# EAGLE design CHIP SmartPhone Core Rev 0.3 (EAGLE 8.1.1)
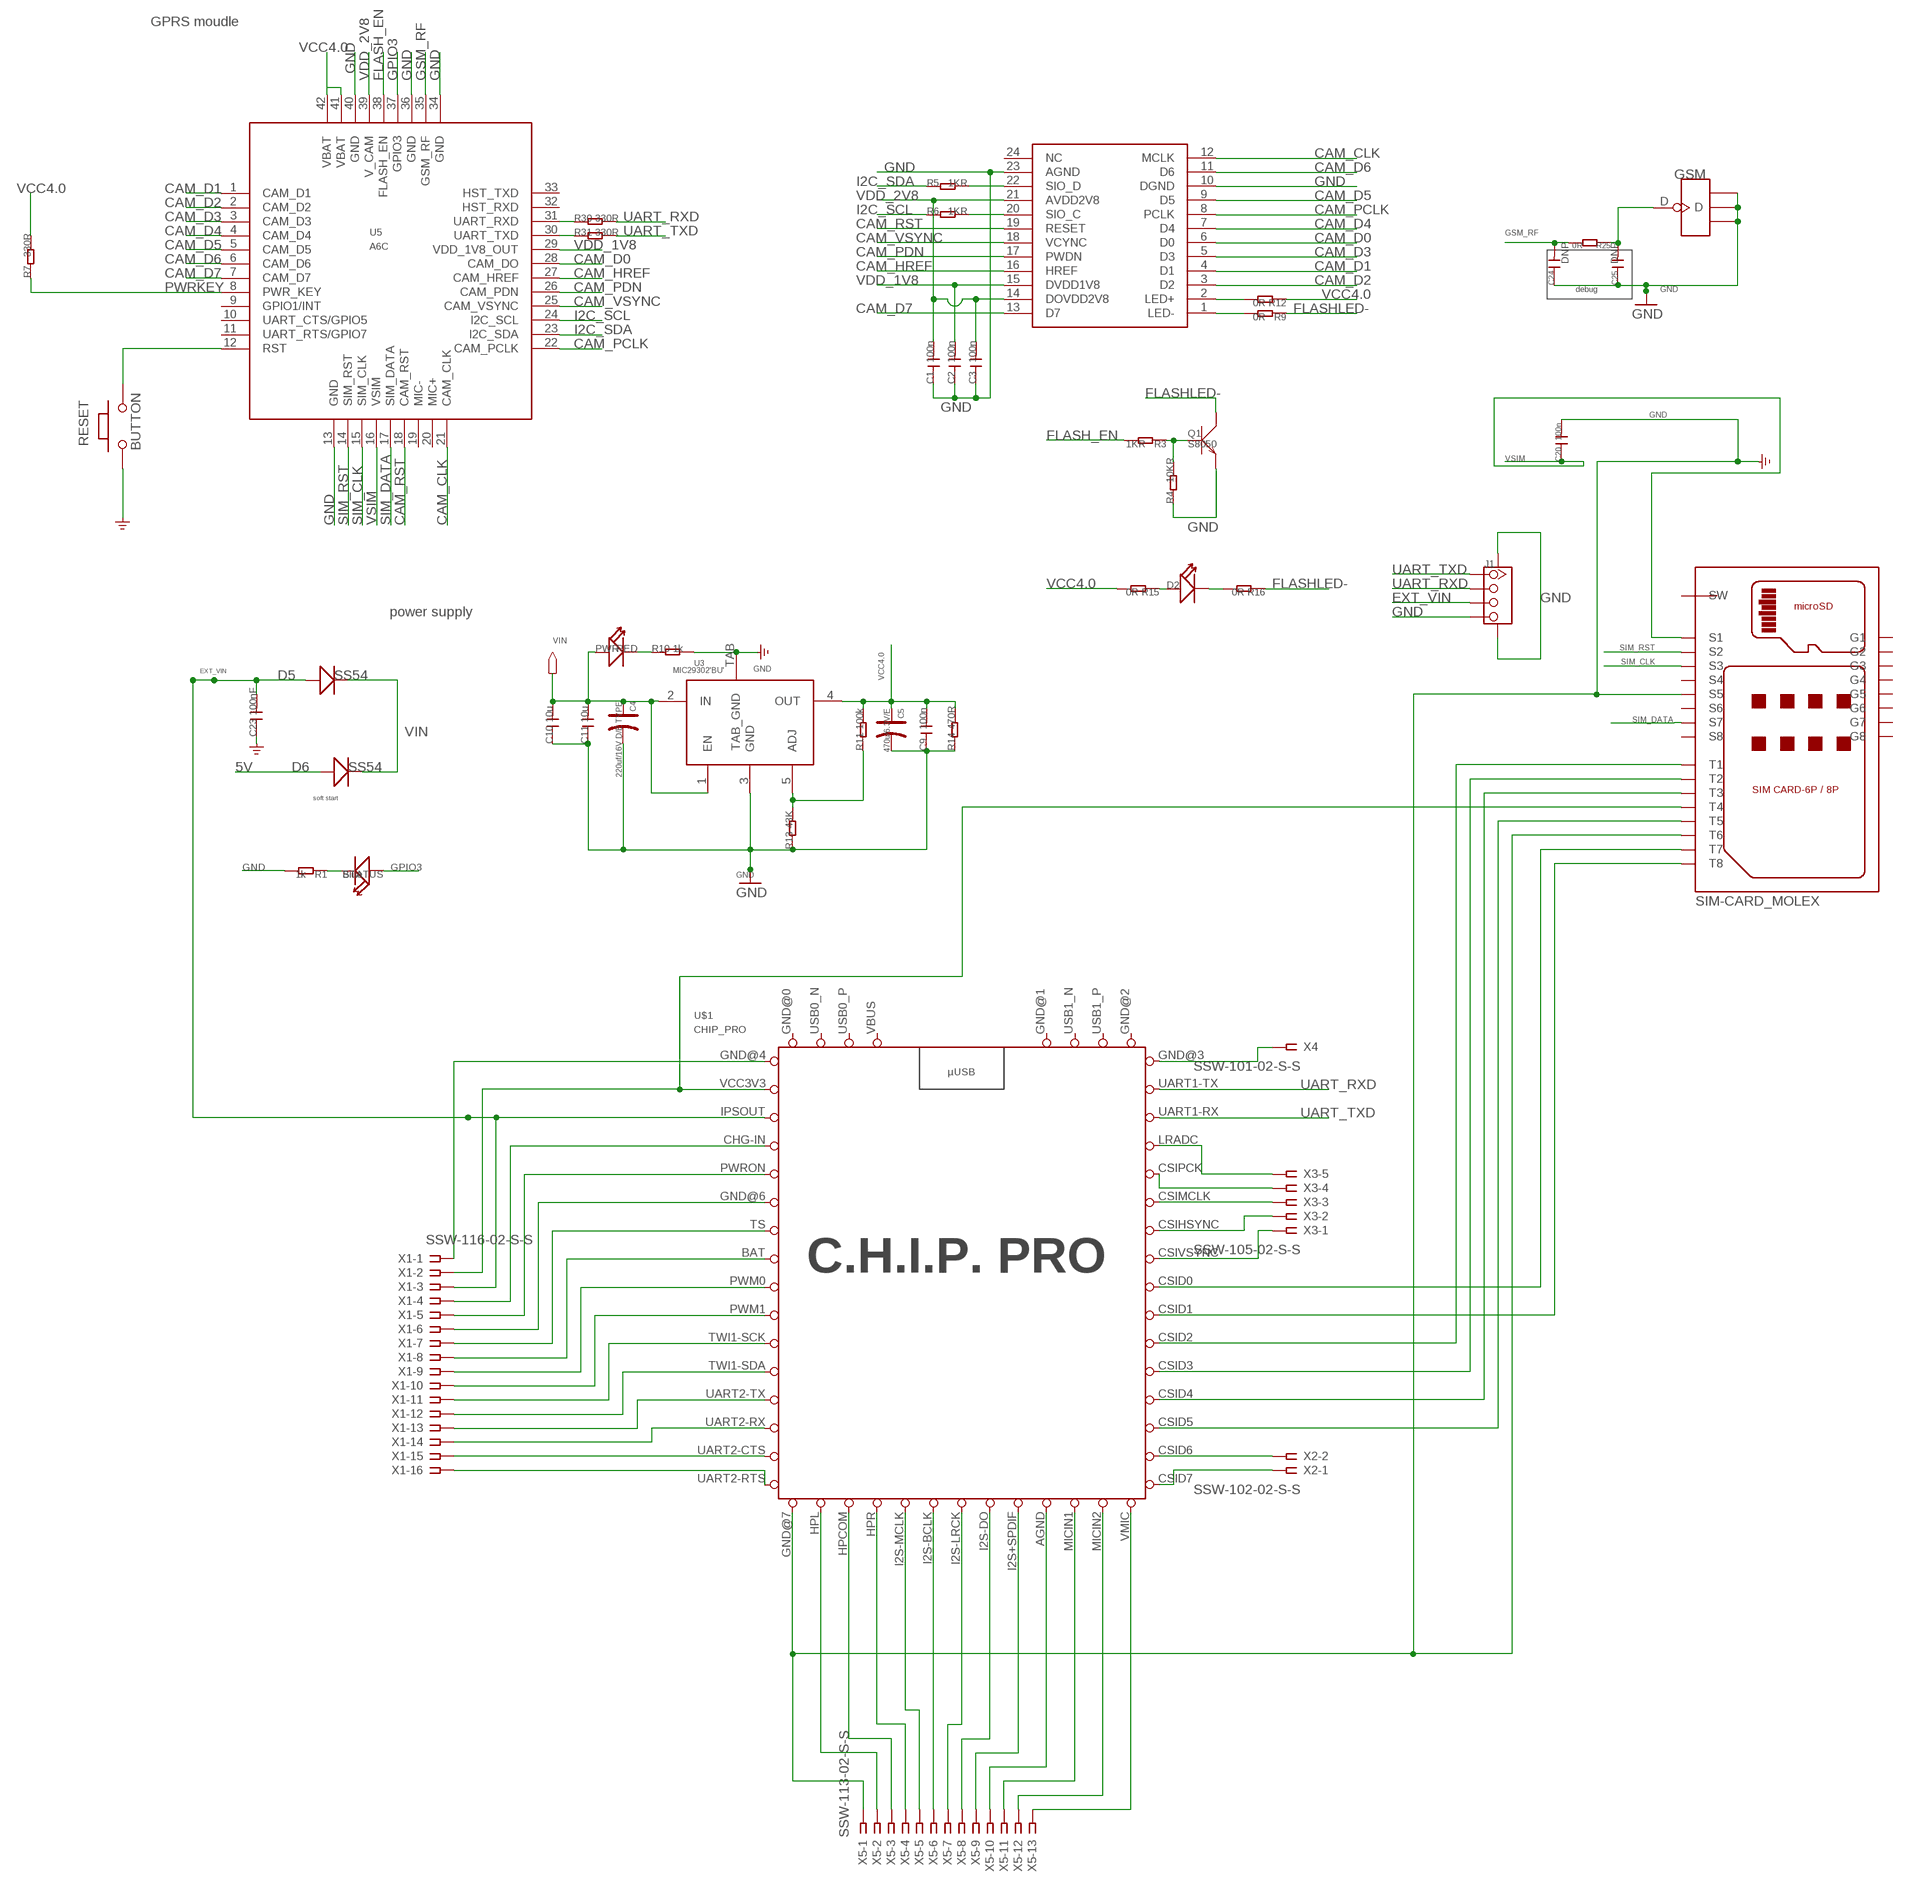
[diagram p0: schematic, sheet 1]

## Parts
C1  100n  C-0603  [C0603]
C2  100n  C-0603  [C0603]
C3  100n  C-0603  [C0603]
C4  220uf/16V D/E TYPE  006-CAP_AVX_D  [AVX_D]
C5  470u/6.3V/E  006-CAP_AVX_D  [AVX_D]
C9  100n  C-0603  [C0603]
C10  10u  C-0603  [C0603]
C11  10u  C-0603  [C0603]
C20  100n  C-0603  [C0603]
C23  100nF  C-0603  [C0603]
C24  DNP  C-0402  [C0402]
C25  DNP  C-0402  [C0402]
D2  LED'0805'  [LED-0805]
D5  SS54  D'MBRS240LT3'  [SMB]
D6  SS54  D'MBRS240LT3'  [SMB]
GSM  ANTENNA-U-FL  [4P-U-FL]
J1  TWIG-4P-2.0-SMD-FEMALE-REINFORCE'90D'  [4P-SMD-2.0-90D]
PWR  RED  007-LED0603  [D0603]
Q1  S8050  TRANSISTOR-NPN-SOT23  [SOT23]
R1  1k  R-0603  [R0603]
R3  1KR  R-0603  [R0603]
R4  10KR  R-0603  [R0603]
R5  1KR  R-0603  [R0603]
R6  1KR  R-0603  [R0603]
R7  330R  R-0603  [R0603]
R9  0R  R-0603  [R0603]
R10  1k  R-0603  [R0603]
R11  100k  R-0603  [R0603]
R12  0R  R-0603  [R0603]
R13  43K  R-0603  [R0603]
R14  470R  R-0603  [R0603]
R15  0R  R-0603  [R0603]
R16  0R  R-0603  [R0603]
R25  0R  R-0402  [R0402]
R30  330R  R-0603  [R0603]
R31  330R  R-0603  [R0603]
RESET  BUTTON  PB157  [157SW]
STATUS  Blue  007-LED0603  [D0603]
U1  FPC-SOCKET-0.5-24P  [24P-0.5-90D]
U3  MIC29302'BU'  [TO-263]
U5  A6C  [A6C]
U$1  CHIP_PRO  [CHIP_PRO]
U$4  SIM-CARD_MOLEX  [SIM-CARD_MOLEX]
X1  SSW-116-02-S-S  [SSW-116-02-S-S]
X2  SSW-102-02-S-S  [SSW-102-02-S-S]
X3  SSW-105-02-S-S  [SSW-105-02-S-S]
X4  SSW-101-02-S-S  [SSW-101-02-S-S]
X5  SSW-113-02-S-S  [SSW-113-02-S-S]

## Nets
5V: D6.+
CAM_CLK: U1.12(MCLK) U5.21(CAM_CLK)
CAM_D0: U1.6(D0) U5.28(CAM_DO)
CAM_D1: U1.4(D1) U5.1(CAM_D1)
CAM_D2: U1.3(D2) U5.2(CAM_D2)
CAM_D3: U1.5(D3) U5.3(CAM_D3)
CAM_D4: U1.7(D4) U5.4(CAM_D4)
CAM_D5: U1.9(D5) U5.5(CAM_D5)
CAM_D6: U1.11(D6) U5.6(CAM_D6)
CAM_D7: U1.13(D7) U5.7(CAM_D7)
CAM_HREF: U1.16(HREF) U5.27(CAM_HREF)
CAM_PCLK: U1.8(PCLK) U5.22(CAM_PCLK)
CAM_PDN: U1.17(PWDN) U5.26(CAM_PDN)
CAM_RST: U1.19(RESET) U5.18(CAM_RST)
CAM_VSYNC: U1.18(VCYNC) U5.25(CAM_VSYNC)
EXT_VIN: C23.2 D5.+ J1.3 U$1.IPSOUT X1.3
FLASH_EN: R3.2 U5.38(FLASH_EN)
FLASHLED-: Q1.3(C) R9.1 R16.1
GND: C1.1 C2.1 C3.1 C4.- C5.- C9.1 C10.1 C11.1 C20.2 C23.1 C24.1 C25.1 GSM.GND1 GSM.GND2 GSM.GND3 J1.4 J1.SS1 J1.SS2 Q1.2(E) R1.2 R4.1 R10.2 R13.1 R14.1 RESET.1 U1.10(DGND) U1.23(AGND) U3.3(GND) U3.TAB(TAB_GND) U5.13(GND) U5.34(GND) U5.36(GND) U5.40(GND) U$1.GND@7(GND) U$4.S5 U$4.T6 X5.1
GPIO3: STATUS.+ U5.37(GPIO3)
GSM_RF: C24.2 R25.2 U5.35(GSM_RF)
I2C_SCL: R6.1 U5.24(I2C_SCL)
I2C_SDA: R5.1 U5.23(I2C_SDA)
N$1: R1.1 STATUS.-
N$2: R30.1 U5.31(UART_RXD)
N$3: Q1.1(B) R3.1 R4.2
N$4: R31.1 U5.30(UART_TXD)
N$5: R11.1 R13.2 U3.5(ADJ)
N$6: D2.+ R15.1
N$7: RESET.2 U5.12(RST)
N$8: R5.2 U1.22(SIO_D)
N$9: D2.- R16.2
N$10: R6.2 U1.20(SIO_C)
N$11: U$1.CSID2 U$4.T1
N$12: U$1.CSID3 U$4.T2
N$13: U$1.CSID4 U$4.T3
N$14: U$1.CSID5 U$4.T5
N$15: U$1.UART2-RTS X1.16
N$16: U$1.VCC3V3 U$4.T4 X1.2
N$17: U$1.CSID0 U$4.T7
N$18: U$1.CSID1 U$4.T8
N$19: PWR.- R10.1
N$20: R9.2 U1.1(LED-)
N$21: R12.2 U1.2(LED+)
N$22: U$1.UART2-CTS X1.15
N$23: U$1.UART2-RX X1.14
N$24: U$1.UART2-TX X1.13
N$25: C25.2 GSM.D R25.1
N$26: U$1.TWI1-SDA X1.12
N$27: U$1.TWI1-SCK X1.11
N$28: U$1.PWM1 X1.10
N$29: U$1.PWM0 X1.9
N$30: U$1.BAT X1.8
N$31: U$1.TS X1.7
N$32: U$1.GND@6(GND) X1.6
N$33: U$1.PWRON X1.5
N$34: U$1.CHG-IN X1.4
N$35: U$1.GND@3(GND) X4.1
N$36: U$1.GND@4(GND) X1.1
N$37: U$1.CSIVSYNC X3.1
N$38: U$1.CSIHSYNC X3.2
N$39: U$1.CSIMCLK X3.3
N$40: U$1.CSIPCK X3.4
N$41: U$1.LRADC X3.5
N$42: U$1.CSID6 X2.2
N$43: U$1.CSID7 X2.1
N$44: U$1.VMIC X5.13
N$45: U$1.MICIN2 X5.12
N$46: U$1.MICIN1 X5.11
N$47: U$1.AGND X5.10
N$48: U$1.I2S+SPDIF(I2SSPDIF) X5.9
N$49: U$1.I2S-DO(I2SDO) X5.8
N$50: U$1.I2S-LRCK(I2SLRCK) X5.7
N$51: U$1.I2S-BCLK(I2SBCLK) X5.6
N$52: U$1.I2S-MCLK(I2SMCLK) X5.5
N$53: U$1.HPR X5.4
N$54: U$1.HPCOM X5.3
N$55: U$1.HPL X5.2
PWRKEY: R7.1 U5.8(PWR_KEY)
SIM_CLK: U5.15(SIM_CLK) U$4.S3
SIM_DATA: U5.17(SIM_DATA) U$4.S7
SIM_RST: U5.14(SIM_RST) U$4.S2
UART_RXD: J1.2 R30.2 U$1.UART1-TX
UART_TXD: J1.1 R31.2 U$1.UART1-RX
VCC4.0: C5.+ C9.2 R7.2 R11.2 R12.1 R14.2 R15.2 U3.4(OUT) U5.41(VBAT) U5.42(VBAT)
VDD_1V8: C2.2 U1.15(DVDD1V8) U5.29(VDD_1V8_OUT)
VDD_2V8: C1.2 C3.2 U1.14(DOVDD2V8) U1.21(AVDD2V8) U5.39(V_CAM)
VIN: C4.+ C10.2 C11.2 D5.- D6.- PWR.+ U3.1(EN) U3.2(IN)
VSIM: C20.1 U5.16(VSIM) U$4.S1
Unconnected: U1.24(NC) U5.9(GPIO1/INT) U5.10(UART_CTS/GPIO5) U5.11(UART_RTS/GPIO7) U5.19(MIC-) U5.20(MIC+) U5.32(HST_RXD) U5.33(HST_TXD) U$1.USB0_N U$1.USB0_P U$1.USB1_N U$1.USB1_P U$4.G1 U$4.G2 U$4.G3 U$4.G4 U$4.G5 U$4.G6 U$4.G7 U$4.G8 U$4.S4 U$4.S6 U$4.S8 U$4.SW

## Notes on the sheet
- GPRS moudle
- debug
- power supply
- soft start

## Power pins joined to a net without a drawn wire
GND: U$1.GND@0(GND) U$1.GND@1(GND) U$1.GND@2(GND)
VBUS: U$1.VBUS

## Library data of the parts
C1-C3 C9-C11 C20 C23-C25 = Discrete:C*: Ceramic Capacitors
C4 C5 = Discrete:006-CAP*: Electrolytic Capacitors,Tantalum Capacitors and Super Capacitors
D2 = Discrete:LED*
D5 D6 = Discrete:D*
GSM = Connector:ANTENNA-U-FL
J1 = Connector:TWIG-4P-2.0-SMD-FEMALE-REINFORCE
PWR STATUS = Discrete:007-LED*
Q1 = Discrete:TRANSISTOR-NPN*: NPN audion
R1 R3-R7 R9-R16 R25 R30 R31 = Discrete:R*
RESET = MySMD:PB157
U1 = Connector:FPC-SOCKET-0.5-24P
U3 = ICs_v54:MIC29302
U5 = IC:A6C
U$1 = CHIP_Pro-Footprint:CHIP_PRO
U$4 = Molex3:SIM-CARD_MOLEX
X1 = con-samtec:SSW-116-02-S-S: THROUGH-HOLE .025" SQ POST SOCKET Source: Samtec SSW.pdf; MPN: SSW-116-02-S-S; OC_FARNELL: unknown; OC_NEWARK: 29C5896
X2 = con-samtec:SSW-102-02-S-S: THROUGH-HOLE .025" SQ POST SOCKET Source: Samtec SSW.pdf; MPN: SSW-102-02-S-S; OC_FARNELL: unknown; OC_NEWARK: 11P9351
X3 = con-samtec:SSW-105-02-S-S: THROUGH-HOLE .025" SQ POST SOCKET Source: Samtec SSW.pdf; MPN: SSW-105-02-S-S; OC_FARNELL: unknown; OC_NEWARK: 11P9399
X4 = con-samtec:SSW-101-02-S-S: THROUGH-HOLE .025" SQ POST SOCKET Source: Samtec SSW.pdf; MPN: SSW-101-02-S-S; OC_FARNELL: unknown; OC_NEWARK: 11P9336
X5 = con-samtec:SSW-113-02-S-S: THROUGH-HOLE .025" SQ POST SOCKET Source: Samtec SSW.pdf; MPN: SSW-113-02-S-S; OC_FARNELL: unknown; OC_NEWARK: 11P9532

## Net classes
1 power: width 0.61 mm, drill 0.61 mm, clearance 0.203 mm
2 gnd: width 0.305 mm, drill 0.559 mm, clearance 0.203 mm
3 usbvcc: width 0.508 mm, drill 0.61 mm, clearance 0.203 mm
4 aref: width 0.254 mm, drill 0.61 mm, clearance 0.254 mm

## Board
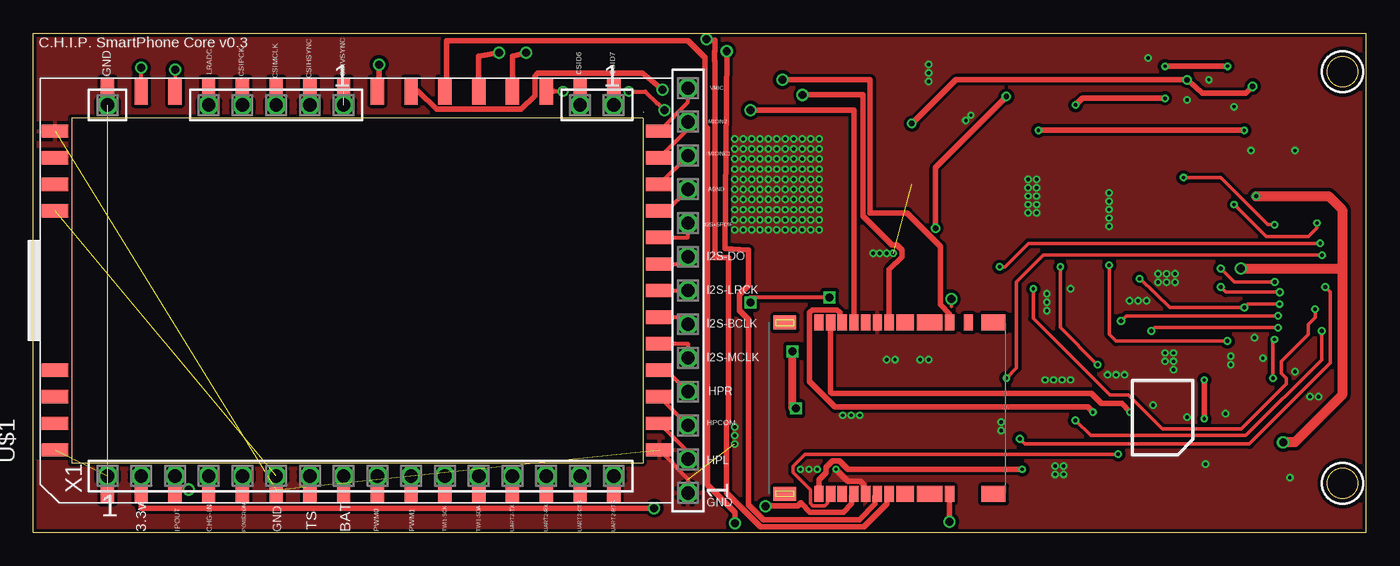
[diagram p1: board, top side]
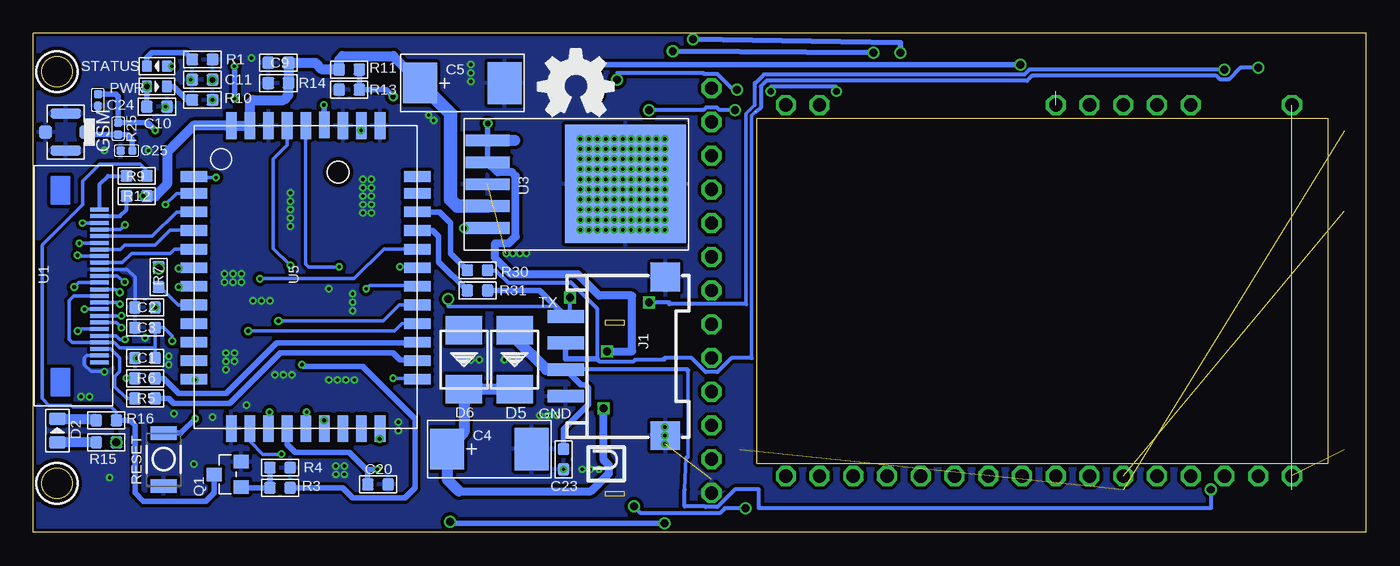
[diagram p2: board, bottom side, seen from below]

Size 100.33 x 37.59 mm. Coordinates in mm from the lower left corner, seen from the top.
Outline: 0,0 0,37.59 100.33,37.59 100.33,0 0,0
Outline: circle at 98.55,34.7 radius 1.14
Outline: circle at 98.55,3.7 radius 1.14
Copper layers (1*16): Top 0.035mm / dielectric 1.5mm / Bottom 0.035mm
Design rules "default": minimum track width 6mil, minimum drill 10mil, track to track 6mil, track to pad 6mil, pad to pad 6mil, via to via 6mil, smd to smd 0mil, copper to edge 10mil, drill to drill 10mil, minimum pad ring 10mil, minimum via ring 6mil, stop-mask expansion 2mil, vias tented up to drill 100mil, thermal gap 10mil
tRestrict: area 97,33.2 to 100.1,36.2; area 97,2.2 to 100.1,5.2
bRestrict: area 97,33.2 to 100.1,36.2; area 97,2.2 to 100.1,5.2

### Footprints (pad centres in the part's own frame; a part is rotated, then mirrored left to right if it is on the bottom)
C0603 = smd 0.889 x 0.889: 1 -0.762,0; 2 0.762,0
AVX_D = smd 2.54 x 3.048: + -3.175,0 | smd 2.54 x 3.175: - 3.175,0
C0402 = smd 0.635 x 0.635: 1 -0.445,0; 2 0.445,0
LED-0805 = smd 0.889 x 1.27: + -0.889,0; - 0.889,0
SMB = smd 2.159 x 2.743: + -2.21,0; - 2.21,0
4P-U-FL = smd 1.016 x 1.016: D -1.524,0; GND3 1.524,0 | smd 2.286 x 0.762: GND1 0,1.397; GND2 0,-1.397
4P-SMD-2.0-90D = smd 0.965 x 2.74: 1 -3,-0.1; 2 -1,-0.1; 3 1,-0.1; 4 3,-0.1 | smd 2.159 x 2.184: SS1 -5.974,7.4; SS2 5.974,7.4
D0603 = smd 0.762 x 0.889: + -0.762,0; - 0.762,0
SOT23 = smd 1.016 x 1.143: 1 -0.95,-1.016; 2 0.95,-1.016; 3 0,1.016
R0603 = smd 0.889 x 0.889: 1 -0.762,0; 2 0.762,0
R0402 = smd 0.635 x 0.635: 1 -0.445,0; 2 0.445,0
157SW = smd 1.016 x 1.981: 1 0,0; 2 4,0
24P-0.5-90D = smd 0.3 x 1.4: 1 5.08,-1.27; 2 4.58,-1.27; 3 4.08,-1.27; 4 3.58,-1.27; 5 3.08,-1.27; 6 2.58,-1.27; 7 2.08,-1.27; 8 1.58,-1.27; 9 1.08,-1.27; 10 0.58,-1.27; 11 0.08,-1.27; 12 -0.42,-1.27; 13 -0.92,-1.27; 14 -1.42,-1.27; 15 -1.92,-1.27; 16 -2.42,-1.27; 17 -2.92,-1.27; 18 -3.42,-1.27; 19 -3.92,-1.27; 20 -4.42,-1.27; 21 -4.92,-1.27; 22 -5.42,-1.27; 23 -5.92,-1.27; 24 -6.42,-1.27
TO-263 = smd 3.302 x 0.889: 1 3.302,-3.302; 2 3.302,-1.651; 3 3.302,0; 4 3.302,1.651; 5 3.302,3.302 | smd 9.12 x 8.89: TAB -7.071,-0.03
A6C = smd 0.8 x 2: 1 7.57,8.4; 2 6.3,8.4; 3 4.9,8.4; 4 3.5,8.4; 5 2.1,8.4; 6 0.7,8.4; 7 -0.7,8.4; 8 -2.1,8.4; 9 -3.5,8.4; 10 -4.9,8.4; 11 -6.3,8.4; 12 -7.7,8.4; 22 -7.7,-8.4; 23 -6.3,-8.4; 24 -4.9,-8.4; 25 -3.5,-8.4; 26 -2.1,-8.4; 27 -0.7,-8.4; 28 0.7,-8.4; 29 2.1,-8.4; 30 3.5,-8.4; 31 4.9,-8.4; 32 6.3,-8.4; 33 7.57,-8.4 | smd 2 x 0.8: 13 -11.4,5.6; 14 -11.4,4.2; 15 -11.4,2.8; 16 -11.4,1.4; 17 -11.4,0; 18 -11.4,-1.4; 19 -11.4,-2.8; 20 -11.4,-4.2; 21 -11.4,-5.6; 34 11.4,-5.6; 35 11.4,-4.2; 36 11.4,-2.8; 37 11.46,-1.4; 38 11.4,0; 39 11.4,1.4; 40 11.4,2.8; 41 11.4,4.2; 42 11.4,5.6
CHIP_PRO = smd 1 x 2: AGND 6,-22.5; GND@1 -12,-22.5; GND@4 -12,23; GND@6 6,23; GND@7 12,23; HPCOM -8,-22.5; HPL -10,-22.5; HPR -6,-22.5; I2S+SPDIF 4,-22.5; I2S-BCLK -2,-22.5; I2S-DO 2,-22.5; I2S-LRCK 0,-22.5; I2S-MCLK -4,-22.5; MICIN1 8,-22.5; MICIN2 10,-22.5; USB0_N -10,23; USB0_P -8,23; USB1_N 8,23; USB1_P 10,23; VBUS -6,23; VMIC 12,-22.5 | smd 2 x 1: BAT -15,1.27; CHG-IN -15,11.43; CSID0 15,-1.27; CSID1 15,-3.81; CSID2 15,-6.35; CSID3 15,-8.89; CSID4 15,-11.43; CSID5 15,-13.97; CSID6 15,-16.51; CSID7 15,-19.05; CSIHSYNC 15,3.81; CSIMCLK 15,6.35; CSIPCK 15,8.89; CSIVSYNC 15,1.27; GND@0 15,19.05; GND@2 -15,6.35; GND@3 -15,19.05; IPSOUT -15,13.97; LRADC 15,11.43; PWM0 -15,-1.27; PWM1 -15,-3.81; PWRON -15,8.89; TS -15,3.81; TWI1-SCK -15,-6.35; TWI1-SDA -15,-8.89; UART1-RX 15,13.97; UART1-TX 15,16.51; UART2-CTS -15,-16.51; UART2-RTS -15,-19.05; UART2-RX -15,-13.97; UART2-TX -15,-11.43; VCC3V3 -15,16.51
SIM-CARD_MOLEX = smd 1.05 x 1.7: G1 0,1.2; G8 12.91,1.2 | smd 1.2 x 1.34: G2 0,10.25; G7 12.91,10.25 | smd 1.2 x 1.94: G3 0,12.09; G6 12.91,12.09 | smd 1.2 x 1.8: G4 0,16.9; G5 12.91,16.9 | smd 1.2 x 0.7: S1 12.91,3.76; S2 12.91,4.64; S3 0,4.64; S4 0,3.76; S5 12.91,7.28; S6 12.91,5.52; S7 0,5.52; S8 0,7.28; SW 0,15.015; T1 12.91,13.6; T2 12.91,9.04; T3 12.91,8.16; T4 12.91,6.4; T5 0,6.4; T6 0,8.16; T7 0,9.04; T8 0,13.6
SSW-116-02-S-S = drill 1 pad 1.5 octagon: 1 -19.05,0; 2 -16.51,0; 3 -13.97,0; 4 -11.43,0; 5 -8.89,0; 6 -6.35,0; 7 -3.81,0; 8 -1.27,0; 9 1.27,0; 10 3.81,0; 11 6.35,0; 12 8.89,0; 13 11.43,0; 14 13.97,0; 15 16.51,0; 16 19.05,0
SSW-102-02-S-S = drill 1 pad 1.5 octagon: 1 -1.27,0; 2 1.27,0
SSW-105-02-S-S = drill 1 pad 1.5 octagon: 1 -5.08,0; 2 -2.54,0; 3 0,0; 4 2.54,0; 5 5.08,0
SSW-101-02-S-S = drill 1 pad 1.5 octagon: 1 0,0
SSW-113-02-S-S = drill 1 pad 1.5 octagon: 1 -15.24,0; 2 -12.7,0; 3 -10.16,0; 4 -7.62,0; 5 -5.08,0; 6 -2.54,0; 7 0,0; 8 2.54,0; 9 5.08,0; 10 7.62,0; 11 10.16,0; 12 12.7,0; 13 15.24,0

### Placement (x,y rotation side)
C1  91.91,13.13 0 bottom
C2  91.91,16.94 0 bottom
C3  91.91,15.42 0 bottom
C4  66,6.28 0 bottom
C5  68.03,33.83 0 bottom
C9  81.88,35.36 0 bottom
C10  91.02,32.06 180 bottom
C11  87.59,34.09 0 bottom
C20  74.38,3.61 0 bottom
C23  60.41,5.51 90 bottom
C24  95.47,32.56 90 bottom
C25  93.31,28.75 0 bottom
D2  98.51,7.67 90 bottom
D5  64.1,13.01 270 bottom
D6  67.91,13.01 270 bottom
GSM  97.88,30.15 180 bottom
J1  60.16,13.26 270 bottom
LOGO2  LOGO-OSHW-FILLX0200-NT  [OSHW_FILLX200_NOTEXT]  62.33,31.33 0 bottom
PWR  91.02,33.58 0 bottom
Q1  85.69,4.37 90 bottom
R1  87.59,35.61 0 bottom
R3  81.75,3.35 0 bottom
R4  81.75,4.88 180 bottom
R5  91.91,10.08 180 bottom
R6  91.91,11.61 180 bottom
R7  90.89,19.23 90 bottom
R9  92.54,26.85 180 bottom
R10  87.59,32.56 0 bottom
R11  76.54,34.85 180 bottom
R12  92.54,25.32 180 bottom
R13  76.54,33.33 0 bottom
R14  81.88,33.83 0 bottom
R15  94.83,6.78 0 bottom
R16  94.83,8.43 180 bottom
R25  93.94,30.41 90 bottom
R30  66.89,19.74 0 bottom
R31  66.89,18.21 0 bottom
RESET  90.51,3.48 90 bottom
STATUS  91.02,35.1 180 bottom
U1  96.61,19.23 90 bottom
U3  62.83,26.21 180 bottom
U5  79.82,19.23 90 bottom
U$1  24.64,18.21 90 top
U$4  55.37,15.8 270 top
X1  24.64,4.24 0 top
X2  42.42,32.18 180 top
X3  18.29,32.18 180 top
X4  5.59,32.18 0 top
X5  49.28,18.21 90 top

### Tracks (layer width: path | path; a pad name or v marks a point on that pad's centre or on a via)
CAM_CLK  (via drill 0.3)
  Top 0.254: v74.26,7.04 74.64,6.66 91.53,6.66 97.62,12.75 97.62,18.09 v97.24,18.47
  Bottom 0.254: U1.12 96.9,18.81 v97.24,18.47 | v74.26,7.04 74.26,7.79 U5.21
CAM_D0  (via drill 0.25)
  Top 0.254: v96.86,21.77 74.89,21.77 73.11,19.99 v72.73,19.99
  Bottom 0.254: U1.6 96.82,21.81 v96.86,21.77 | v72.73,19.99 71.48,19.99 U5.28
CAM_D1  (via drill 0.25)
  Top 0.254: v86.58,26.72 89.37,26.72 92.93,23.17 v93.43,23.17
  Bottom 0.254: U1.4 93.79,22.81 v93.43,23.17 | v86.58,26.72 88.14,26.72 U5.1
CAM_D2  (via drill 0.25)
  Top 0.254: v96.61,23.29 96.61,22.91 95.97,22.28 92.8,22.28 v90.39,24.69
  Bottom 0.254: U1.3 96.59,23.31 v96.61,23.29 | v90.39,24.69 89.55,25.53 U5.2
CAM_D3
  Bottom 0.254: U1.5 91.37,22.31 89.55,24.13 U5.3
CAM_D4
  Bottom 0.254: U5.4 88.28,22.79 90,22.79 91.15,21.64 93.43,21.64 93.77,21.31 U1.7
CAM_D5
  Bottom 0.254: U1.9 93.62,20.31 92.93,21.01 90,21.01 89.68,21.33 U5.5
CAM_D6  (via drill 0.3)
  Top 0.254: v93.43,18.85 90.39,18.85 v89.37,19.86
  Bottom 0.254: U1.11 94.02,19.31 v93.43,18.85 | v89.37,19.86 88.28,19.86 U5.6
CAM_D7  (via drill 0.3)
  Top 0.254: v93.81,18.09 89.75,18.09 v89.37,18.47
  Bottom 0.254: U1.13 94.16,18.31 v93.81,18.09 | v89.37,18.47 88.28,18.47 U5.7
CAM_HREF  (via drill 0.25)
  Top 0.254: v96.48,16.82 96.48,16.18 95.97,15.67 95.97,14.91 93.94,12.88 93.94,11.99 94.32,11.61 94.32,11.19 90.93,7.8 84.96,7.8 82.42,10.34 81.03,10.34 75.27,16.09 v75.27,18.34
  Bottom 0.254: U1.16 v96.47,16.81 v96.48,16.82 | v75.27,18.34 75.02,18.59 71.48,18.59 U5.27
CAM_PCLK  (via drill 0.25)
  Top 0.254: v96.99,20.88 76.03,20.88 74,18.85 74,12.37 v73.24,11.61
  Bottom 0.254: U1.8 96.92,20.81 v96.99,20.88 | v73.24,11.61 71.5,11.61 U5.22
CAM_PDN  (via drill 0.25, 0.3)
  Top 0.254: v93.69,16.31 82.26,16.31 v81.88,15.93
  Bottom 0.254: U1.17 94.32,16.31 v93.69,16.31 | v81.88,15.93 74,15.93 72.8,17.13 U5.26
CAM_RST  (via drill 0.3)
  Top 0.254: v96.99,15.16 96.99,13.01 91.27,7.29 79.59,7.29 v78.45,8.43
  Bottom 0.254: U1.19 96.85,15.31 v96.99,15.16 | v78.45,8.43 78.45,7.86 U5.18
CAM_VSYNC  (via drill 0.25, 0.3)
  Top 0.254: v93.69,15.42 84.42,15.42 v84.16,15.16
  Bottom 0.254: U1.18 94.08,15.81 v93.69,15.42 | v84.16,15.16 73.11,15.16 72.55,15.73 U5.25
EXT_VIN  (via drill 0.6)
  Top 0.254: 10.79,3.34 U$1.IPSOUT
  Top 0.305: v11.68,3.23 10.67,3.23 U$1.IPSOUT X1.3
  Bottom 0.254: 51.31,3.23 51.18,5.64 51.05,5.64 51.05,12.26
  Bottom 0.305: J1.3 51.05,12.26 51.05,12.12 | v11.68,3.23 11.68,1.83 45.72,1.83 45.72,3.23 47.52,3.23 48.84,1.91 49.72,1.91 49.76,1.96 51.31,1.96 51.31,3.23
  Bottom 0.406: J1.3 59.1,11.1 58.74,11.1 58.53,10.89 58.53,9.63 60.41,7.75 C23.2
  Bottom 0.813: D5.+ 64.1,14.66 61.7,12.26 J1.3
FLASH_EN  (via drill 0.25)
  Top 0.254: v77.3,19.99 77.3,15.42 v80.1,12.62
  Bottom 0.254: U5.38 79.82,20.22 79.59,19.99 v77.3,19.99
  Bottom 0.406: R3.2 77.05,3.35 76.29,2.59 72.35,2.59 71.59,3.35 71.59,8.56 75.53,12.5 79.97,12.5 v80.1,12.62
FLASHLED-
  Bottom 0.254: R9.1 91.78,27.23 92.29,27.74 95.34,27.74 96.61,26.47 96.61,24.69 99.66,21.64 99.66,10.08 99.15,9.58 97.5,9.58 97.37,9.45 94.45,9.45 94.07,9.07 R16.1
  Bottom 0.406: R16.1 93.05,8.43 92.67,8.05 92.67,2.97 92.04,2.34 87.34,2.34 86.7,2.97 Q1.3
GND  (via drill 0.25)  (4 unrouted)
  Top 0.305: U$1.GND@1 48.22,5.13 48.22,5.07 49.28,4.02 X5.1
  Top 0.406: U$4.S5 62.48,3.06 62.48,3.64 62.27,3.85 61.32,3.85 C23.1
  Bottom 0.254: U1.10 93.25,19.81 92.67,19.23 C2.1 | U1.23 96.31,13.31 96.48,13.13 96.48,12.62 95.97,12.12 v94.96,12.12
  other vias: 89.75,8.94 92.54,13.13 96.1,10.21 94.58,4.12 88.23,5.13 91.91,14.66 90.13,12.62 86.83,32.56 88.48,34.09 83.91,35.74 67.4,34.6 63.72,21.01 70.57,31.42 70.19,31.04 64.22,21.01 64.73,21.01 63.21,21.01 67.4,33.96 67.4,35.23 90.39,32.06 91.66,28.75 94.96,28.75 60.41,4.75 57.75,4.75 52.79,7.93 52.79,7.29 52.79,6.66 86.83,8.69 85.81,12.88 82.13,11.86 77.56,5 77.56,4.37 76.92,5 76.92,4.37 85.18,12.88 85.81,12.24 85.81,13.51 85.18,13.51 81.5,11.86 80.86,11.86 84.29,9.58 82.51,17.45 85.94,19.48 76.8,11.48 67.4,13.01 72.86,8.31 78.07,18.34 76.29,17.32 80.99,23.04 80.99,23.67 80.99,24.31 77.43,11.48 78.07,11.48 76.16,11.48 76.29,17.96 76.29,16.69 85.31,19.48 84.67,19.48 84.67,18.85 85.31,18.85 85.94,18.85 83.15,17.45 83.78,17.45 90.13,13.26 96.74,10.21 72.86,7.67 66.76,13.01 64.86,13.01 64.22,13.01 75.53,26.59 74.89,26.59 75.53,25.96 75.53,25.32 75.53,24.69 75.53,24.05 74.89,25.96 74.89,25.32 74.89,24.69 74.89,24.05 80.99,24.94 80.99,25.58 59.14,29.64 58.51,29.64 57.87,29.64 57.24,29.64 56.6,29.64 55.97,29.64 55.33,29.64 54.7,29.64 54.06,29.64 53.43,29.64 52.79,29.64 59.14,28.12 58.51,28.12 57.87,28.12 57.24,28.12 56.6,28.12 55.97,28.12 55.33,28.12 54.7,28.12 54.06,28.12 53.43,28.12 52.79,28.12 59.14,28.88 58.51,28.88 57.87,28.88 57.24,28.88 56.6,28.88 55.97,28.88 55.33,28.88 54.7,28.88 54.06,28.88 53.43,28.88 52.79,28.88 59.14,27.36 58.51,27.36 57.87,27.36 57.24,27.36 56.6,27.36 55.97,27.36 55.33,27.36 54.7,27.36 54.06,27.36 53.43,27.36 52.79,27.36 59.14,26.59 58.51,26.59 57.87,26.59 57.24,26.59 56.6,26.59 55.97,26.59 55.33,26.59 54.7,26.59 54.06,26.59 53.43,26.59 52.79,26.59 59.14,25.83 58.51,25.83 57.87,25.83 57.24,25.83 56.6,25.83 55.97,25.83 55.33,25.83 54.7,25.83 54.06,25.83 53.43,25.83 52.79,25.83 59.14,25.07 58.51,25.07 57.87,25.07 57.24,25.07 56.6,25.07 55.97,25.07 55.33,25.07 54.7,25.07 54.06,25.07 53.43,25.07 52.79,25.07 59.14,24.31 58.51,24.31 57.87,24.31 57.24,24.31 56.6,24.31 55.97,24.31 55.33,24.31 54.7,24.31 54.06,24.31 53.43,24.31 52.79,24.31 59.14,23.55 58.51,23.55 57.87,23.55 57.24,23.55 56.6,23.55 55.97,23.55 55.33,23.55 54.7,23.55 54.06,23.55 53.43,23.55 52.79,23.55 59.14,22.79 58.51,22.79 57.87,22.79 57.24,22.79 56.6,22.79 55.97,22.79 55.33,22.79 54.7,22.79 54.06,22.79 53.43,22.79 52.79,22.79 62.19,8.81 61.56,8.81 60.92,8.81 59.02,4.75 58.38,4.75
  pour Bottom (isolate 0.254): -4.99,-0.58 122.14,-0.71 123.28,38.53 -3.85,38.66
  pour Top (isolate 0.254): 124.12,-1.09 -3.77,-0.46 -4.92,38.79 122.97,38.15
GPIO3  (via drill 0.25)
  Top 0.406: v89.88,35.1 v85.18,35.1 | v85.18,32.69 78.96,32.69 v78.45,32.18
  Bottom 0.406: STATUS.+ v89.88,35.1 | v85.18,35.1 v85.18,32.69 | v78.45,32.18 78.45,30.72 U5.37
GSM_RF  (via drill 0.25)
  Top 0.406: v91.15,30.28 v75.65,30.28
  Bottom 0.406: v91.15,30.28 91.72,30.85 R25.2 93.94,32.82 94.13,33.01 C24.2 | 75.65,30.53 v75.65,30.28 75.62,30.31 U5.35
I2C_SCL
  Bottom 0.406: R6.1 90.51,11.61 89.37,10.47 85.81,10.47 82,14.28 71.47,14.28 U5.24
I2C_SDA
  Bottom 0.406: R5.1 90.13,10.08 89.75,9.7 85.56,9.7 81.75,13.51 73.24,13.51 72.73,13.01 71.5,13.01 U5.23
N$1
  Bottom 0.406: STATUS.- 91.78,35.74 91.4,36.12 88.86,36.12 R1.1
N$2
  Bottom 0.406: U5.31 69.76,24.13 68.92,23.29 68.92,21.01 R30.1
N$3
  Bottom 0.406: Q1.1 84.6,3.35 R3.1 R4.2
N$4
  Bottom 0.406: U5.30 70.26,22.73 69.81,22.28 69.81,20.37 R31.1
N$5  (via drill 0.41)
  Top 0.406: v67.91,22.91 67.91,27.48 v73.24,32.82
  Bottom 0.406: R11.1 R13.2 73.75,33.33 v73.24,32.82 | U3.5 v67.91,22.91
N$6
  Bottom 0.762: R15.1 D2.+
N$7  (via drill 0.25)
  Top 0.406: v88.14,8.56 v88.14,11.48
  Bottom 0.406: RESET.2 89.18,7.48 89.18,7.52 v88.14,8.56 | v88.14,11.48 88.14,11.45 U5.12
N$8
  Bottom 0.254: U1.22 94.49,13.81 93.81,13.13 93.81,12.12 94.2,11.74 94.2,10.97 93.31,10.08 R5.2
N$9
  Bottom 0.762: D2.- 95.72,8.56 R16.2
N$10  (via drill 0.25)
  Top 0.254: v93.31,11.61 93.31,14.4 v93.43,14.53
  Bottom 0.254: U1.20 94.09,14.81 93.81,14.53 v93.43,14.53 | v93.31,11.61 R6.2
N$11  (via drill 0.6)
  Top 0.406: U$1.CSID2 31.12,33.21 31.12,37.01 49.28,37.01 50.55,35.74 50.55,30.66 50.75,30.46 50.75,3.6 52.83,1.52 v52.83,0.69 | v68.96,0.81 v68.97,0.81 U$4.T1
  Bottom 0.406: v52.83,0.69 68.96,0.69 v68.96,0.81
N$12  (via drill 0.6)
  Top 0.406: U$4.T2 64.24,2.72 64.24,2.14 62.51,0.41 54.73,0.41 52.16,2.98 52.16,8.19 52.32,8.35 52.32,20.7 51.31,20.7 51.31,35.48 51.26,35.53 51.26,36.2 51.31,36.25 51.31,37.07 51.18,37.07 50.93,37.07 v50.67,37.14 | v35.05,36.12 33.53,35.87 U$1.CSID3
  Bottom 0.406: v50.67,37.14 35.05,36.88 v35.05,36.12
N$13  (via drill 0.6)
  Top 0.406: U$4.T3 63.36,2.72 63.36,2.14 62.18,0.97 55.39,0.97 54.96,0.97 53.85,2.08 53.85,16.04 53.17,16.72 53.17,17.92 53.85,18.61 53.85,21.26 52.07,21.39 v52.2,36.25 | v37.08,36.12 36.07,35.87 U$1.CSID4
  Bottom 0.406: v52.2,36.25 v37.08,36.12
N$14  (via drill 0.5, 0.6)
  Top 0.305: 39.15,33.21 39.88,33.21 v39.88,33.2 | v47.5,31.8 46.98,32.31 46.93,32.31 46.05,33.2 v44.83,33.2
  Top 0.406: U$1.CSID5 39.15,33.21 | v47.5,31.8 47.44,31.86 | v53.98,31.8 61.77,31.8 U$4.T5
  Bottom 0.305: v39.88,33.2 39.88,33.56 44.83,33.56 v44.83,33.2 | v47.5,31.8 48.67,31.8 48.84,31.97 49.72,31.97 49.88,31.8 v53.98,31.8
N$15
  Top 0.305: U$1.UART2-RTS X1.16
N$16  (via drill 0.6)
  Top 0.305: U$1.VCC3V3 X1.2
  Top 0.406: U$4.T4 61.6,2.72 61.6,2.14 60.98,1.53 58.87,1.53 58.47,1.53 57.78,2.22 57.57,2.01 55.17,2.01 v55.12,1.96 | v46.74,1.83 8.13,1.83 U$1.VCC3V3
  Bottom 0.305: 55.12,1.83 v55.12,1.96 54.62,1.46 48.65,1.46 48.27,1.83 v46.74,1.83
N$17  (via drill 0.6)
  Top 0.406: U$1.CSID0 26.04,33.21 v26.04,35.23 | U$4.T7 64.41,19.79 65.37,20.74 65.37,21.27 64.99,21.64 64.61,21.64 62.43,23.82 62.43,32.95 v57.91,32.95
  Bottom 0.406: v26.04,35.23 57.91,35.23 v57.91,32.95
N$18  (via drill 0.6)
  Top 0.406: U$1.CSID1 28.98,33.21 30.34,31.86 36.72,31.86 37.75,32.89 37.75,34.36 37.96,34.57 45.87,34.57 v47.37,33.33 | v56.39,34.09 62.99,34.09 62.99,24.05 65.76,24.05 68.28,21.53 68.28,17.16 68.97,16.46 U$4.T8
  Bottom 0.305: v47.37,33.33 47.65,33.33 48.84,34.51 49.83,34.51 49.91,34.6 56.39,34.6 v56.39,34.09
N$19
  Bottom 0.406: PWR.- 89.75,33.58 88.73,32.56 R10.1
N$20
  Bottom 0.305: U1.1 95.34,26.21 94.7,26.85 R9.2
N$21
  Bottom 0.305: U1.2 93.81,23.81 93.31,24.31 R12.2
N$22
  Top 0.305: U$1.UART2-CTS X1.15
N$23
  Top 0.305: U$1.UART2-RX X1.14
N$24
  Top 0.305: U$1.UART2-TX X1.13
N$25
  Bottom 0.406: GSM.D 96.16,29.96 R25.1 93.24,29.96 92.86,29.58 C25.2
N$26
  Top 0.305: U$1.TWI1-SDA X1.12
N$27
  Top 0.305: U$1.TWI1-SCK X1.11
N$28
  Top 0.305: U$1.PWM1 X1.10
N$29
  Top 0.305: U$1.PWM0 X1.9
N$30
  Top 0.305: U$1.BAT X1.8
N$31
  Top 0.305: U$1.TS X1.7
N$32  (1 unrouted)
N$33
  Top 0.305: U$1.PWRON X1.5
N$34
  Top 0.305: U$1.CHG-IN X1.4
N$35  (1 unrouted)
N$36  (1 unrouted)
N$37  (1 unrouted)
N$38
  Top 0.305: U$1.CSIHSYNC X3.2
N$39
  Top 0.305: U$1.CSIMCLK X3.3
N$40
  Top 0.305: U$1.CSIPCK X3.4
N$41
  Top 0.305: U$1.LRADC X3.5
N$42
  Top 0.305: U$1.CSID6 X2.2
N$43
  Top 0.305: U$1.CSID7 X2.1
N$44
  Top 0.305: U$1.VMIC 48.22,31.29 48.22,31.35 49.28,32.41 X5.13
N$45
  Top 0.305: U$1.MICIN2 49.28,30.35 X5.12
N$46
  Top 0.305: U$1.MICIN1 49.28,28.35 X5.11
N$47
  Top 0.305: U$1.AGND 47.66,24.21 X5.10
N$48
  Top 0.305: U$1.I2S+SPDIF 49.28,22.21 X5.9
N$49
  Top 0.305: U$1.I2S-DO 49.28,20.21 X5.8
N$50
  Top 0.305: U$1.I2S-LRCK X5.7
N$51
  Top 0.305: U$1.I2S-BCLK 49.28,16.21 X5.6
N$52
  Top 0.305: U$1.I2S-MCLK 49.28,14.21 X5.5
N$53
  Top 0.305: U$1.HPR 47.66,12.21 X5.4
N$54
  Top 0.305: U$1.HPCOM 49.28,8.07 X5.3
N$55
  Top 0.305: U$1.HPL 49.28,6.08 X5.2
PWRKEY
  Bottom 0.254: R7.1 90.77,18.47 89.43,17.13 U5.8
SIM_CLK  (via drill 0.25)
  Top 0.406: v82.55,9.07 81.91,9.7 80.39,9.7 79.63,10.47 60.12,10.47 60.01,10.57 U$4.S3
  Bottom 0.406: v82.55,9.07 82.55,7.9 U5.15
SIM_DATA  (via drill 0.25)
  Top 0.406: v79.76,9.07 79.38,9.45 60.35,9.45 58.43,11.37 58.43,16.55 58.63,16.76 60.51,16.76 60.72,16.55 60.72,15.97 U$4.S7
  Bottom 0.406: v79.76,9.07 79.76,7.89 U5.17
SIM_RST  (via drill 0.25)
  Top 0.254: U$4.S2 59.76,2.64 59.76,2.17 59.6,2.01 58.67,2.01 58.5,2.17 58.5,3.2 57.19,4.52 57.19,4.98 58.1,5.89 v81.66,5.89
  Bottom 0.254: v81.66,5.89 83.06,5.89 84.02,6.86 U5.14
UART_RXD  (via drill 0.6)  (1 unrouted)
  Top 0.305: U$1.UART1-TX v8.13,34.98
  Bottom 0.254: 46.27,13.13 46.27,31.37 45.97,31.67 | 52.83,13.13 52.83,13.01
  Bottom 0.305: R30.2 65.52,19.74 64.61,18.82 59.86,18.82 57.91,16.87 57.91,13.06 57.73,12.88 55.14,12.88 55.02,13.01 52.83,13.01 | v8.13,34.98 9.47,34.98 10.35,34.09 10.98,34.09 11.28,34.39 25.16,34.39 25.53,34.02 45.15,34.02 45.57,33.59 45.57,31.99 45.84,31.73 45.88,31.73 45.95,31.66 | 52.83,13.13 50.77,13.13 49.72,12.07 48.84,12.07 47.78,13.13 46.27,13.13
  Bottom 0.406: 57.91,13.06 60.26,13.06 J1.2
UART_TXD  (via drill 0.6)
  Top 0.254: v69.09,17.58 69.09,17.03 | U$1.UART1-RX v10.67,34.85
  Top 0.305: v59.94,17.7 53.98,17.7 v53.98,17.32
  Bottom 0.254: 61.02,17.02 69.09,17.02 v69.09,17.58 | 46.68,17.2 46.68,31.54 46.03,32.18 | 52.45,17.2 52.45,17.32
  Bottom 0.305: J1.1 59.94,16.26 v59.94,17.7 | 52.45,17.32 v53.98,17.32 | v10.67,34.85 25.34,34.85 25.72,34.47 45.33,34.47 45.97,33.83 46.03,33.83 46.03,32.18 | 46.68,17.2 52.45,17.2
  Bottom 0.406: R31.2 62.21,18.21 61.02,17.02 J1.1
VCC4.0  (via drill 0.3, 0.61)
  Top 0.762: v90.89,19.86 98.51,19.86 | R15.2 94.96,6.78 98.51,10.34 98.51,19.86 | v92.04,25.32 97.5,25.32 98.51,24.31 98.51,19.86
  Bottom 0.254: R12.1 v92.04,25.32
  Bottom 0.762: C5.+ 73.24,35.87 77.05,35.87 77.3,35.61 R11.2 78.57,34.85 79.08,35.36 C9.2 R14.2 81.11,32.95 81.5,32.56 83.78,32.56 84.02,32.33 U5.41 U5.42 88.26,30.63 90.26,28.63 90.26,26.21 91.15,25.32 R12.1 | R7.2 v90.89,19.86
  Bottom 1.016: U3.4 68.41,24.56 68.92,25.07 68.92,31.55 C5.+
  other vias: 94.07,6.78
VDD_1V8  (via drill 0.25, 0.3)
  Top 0.254: v83.27,19.1 85.56,16.94 C2.2 91.4,17.2 v93.81,17.2
  Bottom 0.254: U5.29 73.93,21.33 76.16,19.1 v83.27,19.1 | U1.15 93.93,17.31 v93.81,17.2
  other vias: 91.15,16.94
VDD_2V8  (via drill 0.25, 0.3)
  Top 0.254: v89.88,14.4 81.5,14.4 80.99,14.91 v80.99,20.12
  Bottom 0.254: U1.14 97.27,17.81 97.62,17.45 97.62,14.53 97.4,14.31 U1.21 94.23,14.31 93.81,13.89 91.15,13.89 | 91.15,13.89 C3.2 90.51,15.42 89.88,14.78 v89.88,14.4 | 91.15,13.89 C1.2 | U5.39 81.22,29.16 82.26,28.12 82.26,21.39 v80.99,20.12
VIN  (via drill 0.41, 0.6)
  Top 0.406: v66.13,30.79 69.43,34.09 C11.2 87.46,33.58 87.97,33.07 91.27,33.07 PWR.+
  Top 0.61: v57.4,9.32 57.15,9.32 v57.15,13.64
  Bottom 0.406: C10.2 PWR.+ | 86.7,34.09 C11.2 | v66.13,30.79 U3.1 U3.2
  Bottom 0.61: 68.29,3.1 58.36,3.1 57.01,4.45 57.01,5.06 57.4,5.45 v57.4,9.32 | v57.15,13.64 55.24,13.64 55.24,17.83 57.74,17.83 59.34,19.43 64.35,19.43 65.56,20.64 65.56,21.78 64.52,21.78 64.02,22.28 64.02,26.85 64.29,27.12 65.38,27.12 U3.2
  Bottom 0.813: 68.29,3.1 69.18,3.99 C4.+ 67.91,7.54 D6.- D5.- | 64.1,29.52 U3.1
  other vias: 91.78,33.58 86.83,34.09
VSIM  (via drill 0.25)
  Top 0.406: U$4.S1 59.13,3.97 59.65,4.49 59.65,4.89 60.15,5.39 60.68,5.39 61.31,4.75 v74.42,4.75
  Bottom 0.406: U5.16 81.22,6.63 80.61,6.02 76.54,6.02 75.15,4.62 | C20.1 75.15,4.62 | v74.42,4.75 75.02,4.75 75.15,4.62

### Text on the board
tPlace: C.H.I.P. SmartPhone Core v0.3 | GND | LRADC | CSIPCK | CSIMCLK | CSIHSYNC | CSIVSYNC | CSID6 | CSID7 | VMIC | MICIN2 | MICINC1 | AGND | I2S+SPDIF | I2S-DO | I2S-LRCK | I2S-BCLK | I2S-MCLK | HPR | HPCOM | HPL | GND | TS | 3.3v | IPOUT | CHG-IN | POWERON | GND | BAT | PWM0 | PWM1 | TWI1-SCK | TWI1-SDA | UART2-TX | UART2-RX | UART2-CTS | UART2-RTS
bPlace: U
bNames: TX | GND